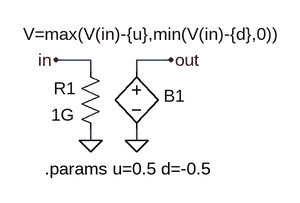
[diagram p0: schematic Dead.asc]
Dead.asc, the LTspice schematic file:
Version 4
SHEET 1 880 680
WIRE 192 80 144 80
WIRE 304 80 256 80
WIRE 192 96 192 80
WIRE 256 96 256 80
WIRE 192 192 192 176
WIRE 256 192 256 176
FLAG 256 192 0
FLAG 144 80 in
FLAG 304 80 out
FLAG 192 192 0
SYMBOL bv 256 80 R0
WINDOW 0 38 50 Left 0
WINDOW 3 -158 -36 Left 0
SYMATTR InstName B1
SYMATTR Value V=max(V(in)-{u},min(V(in)-{d},0))
SYMBOL res 176 80 R0
WINDOW 0 -35 40 Left 0
WINDOW 3 -39 77 Left 0
SYMATTR InstName R1
SYMATTR Value 1G
TEXT 128 232 Left 0 !.params u=0.5 d=-0.5

The netlist it stands for:
* Dead.asc
B1 out 0 V=max(V(in)-{u},min(V(in)-{d},0))
R1 in 0 1G
.params u=0.5 d=-0.5
.backanno
.end